# Altium schematic sheet SH1 - POWER, CAN, LED.SchDoc
size B
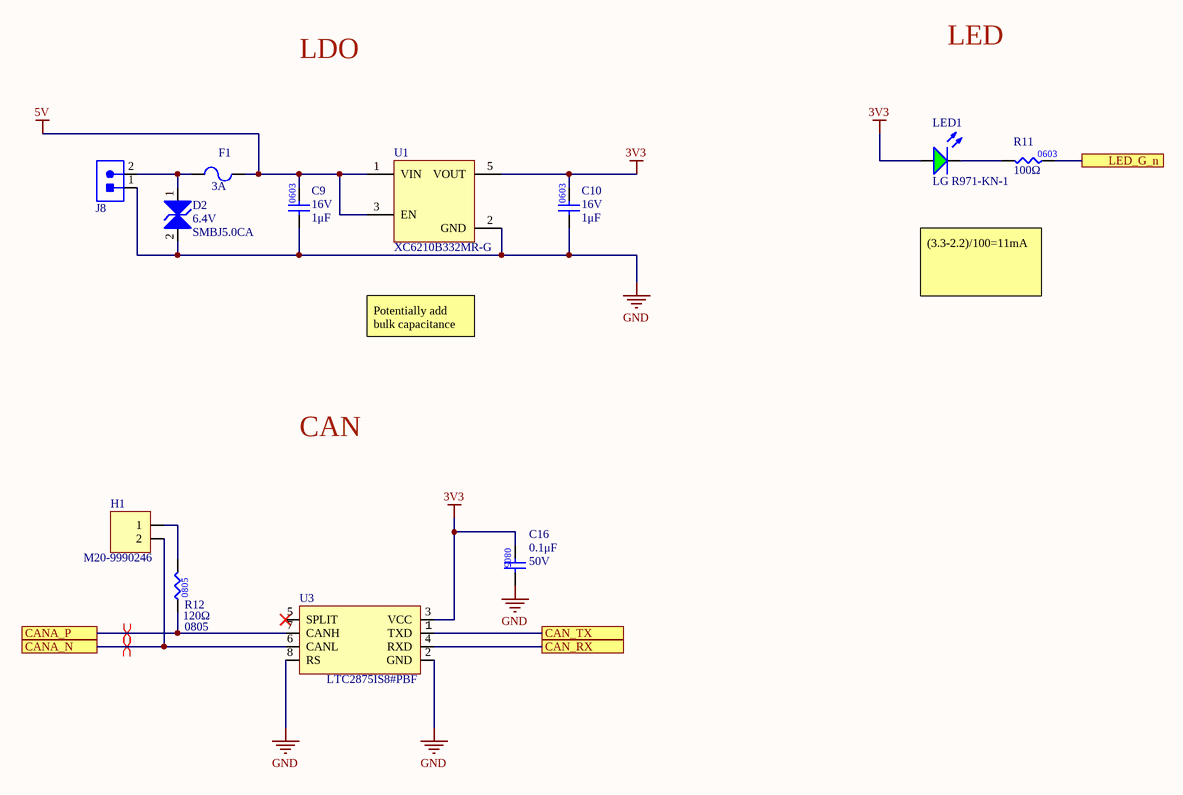
[diagram p0: SH1 - POWER, CAN, LED.SchDoc]

## Parts
C9  value 1μF  Voltage Rating: 16V  [CAP0603]  (hidden comment: CAP_1uF_16V_0603)
C10  value 1μF  Voltage Rating: 16V  [CAP0603]  (hidden comment: CAP_1uF_16V_0603)
C16  value 0.1μF  Voltage Rating: 50V  [CAP0805]  (hidden comment: CAP_0.1uF_50V_0805)
D2  Voltage - Breakdown (Min): 6.4V  Manufacturer Part Number 1: SMBJ5.0CA  [TVS_DIODE_BIDIR_SMB]  (hidden comment: TVS_DIODE_BIDIR_5V)
F1  FUSE_3A_0603  [FUSE_0603]  (value not drawn)
H1  Manufacturer Part Number 1: M20-9990246  [HDR1X2]  (hidden comment: JUMPER)
J8  CON_2POS_SCREW_TERM  [1935161]  (value not drawn)
LED1  Manufacturer Part Number 1: LG R971-KN-1  [LED_0805_GREEN]  (hidden comment: LED_GREEN)
R11  value 100Ω  [RES0603]  (hidden comment: RES_100Ω_0603_1%)
R12  value 120Ω  Package/Footprint: 0805  [RES0805]  (hidden comment: RES_120Ω_0805_1%)
U1  Manufacturer Part Number 1: XC6210B332MR-G  [SOT95P285X140-5N]  (hidden comment: LDO_3.3V_700mA)
U3  Manufacturer Part Number 1: LTC2875IS8#PBF  [LT-S8_N]  (hidden comment: IC_CAN_TRANSCEIVER)

## Ports
CAN_RX, CAN_TX, CANA_N, CANA_P, LED_G_n

## Nets
3V3: C10.2 C16.1 LED1.1(A) U1.5(VOUT) U3.3(VCC)
5V: C9.2 F1.2 U1.1(VIN) U1.3(EN)
GND: C9.1 C10.1 C16.2 D2.2 J8.1 U1.2(GND) U3.2(GND) U3.8(RS)
CAN_RX: U3.4(RXD) ; port CAN_RX
CAN_TX: U3.1(TXD) ; port CAN_TX
CANA_N: H1.2 U3.6(CANL) ; port CANA_N
CANA_P: R12.1 U3.7(CANH) ; port CANA_P
LED_G_n: R11.2 ; port LED_G_n
NetD2_1: D2.1 F1.1 J8.2
NetH1_1: H1.1 R12.2
NetLED1_2: LED1.2(K) R11.1

Not connected (* = marked no-connect by the designer): U3 5(SPLIT)*

## Layout directives
differential pair: CANA_N, CANA_P

## Notes on the sheet
- LDO
- LED
- (3.3-2.2)/100=11mA
- Potentially add bulk capacitance
- CAN
- (in symbol RES_100Ω_0603_1%) 0603

## Library data of the parts
C9 C10 = CAP_1uF_16V_0603: CAP CER 1UF 16V Y5V 0603; Manufacturer 1: Yageo; Manufacturer Part Number 1: CC0603ZRY5V7BB105; Supplier Part Number 1: 311-1372-1-ND; Supplier 1: Digi-Key; Mounting Type: SMD; Package: 0603; Dielectric: Y5V
C16 = CAP_0.1uF_50V_0805: CAP CER 0.1UF 50V X7R 0805; Manufacturer Part Number 1: GCM21BR71H104KA37K; Manufacturer 1: Murata Electronics; Package/Footprint: 0805; Supplier Part Number 1: 490-8049-1-ND; Supplier 1: Digi-Key; Dielectric: X7R; Mounting Type: SMD; LCSC Part #: C49678
D2 = TVS_DIODE_BIDIR_5V: TVS DIODE 5V 9.2V SMB; Manufacturer 1: Littelfuse; Package/Footprint: SMB; Supplier Part Number 1: SMBJ5.0CALFCT-ND; Supplier 1: Digi-Key; Mounting Type: SMD; Voltage - Reverse Standoff (Typ): 5V; Voltage - Clamping (Max) @ Ipp: 9.2V; Verified: No; LCSC Part #: *
F1 = FUSE_3A_0603: FUSE SMD 3A 32V 0603; Manufacturer Part Number 1: 0467003.NR; Manufacturer 1: Littelfuse; Supplier Part Number 1: F1399CT-ND; Supplier 1: Digi-Key; Voltage Rating (DC): 32V; Current Rating: 3A
H1 = JUMPER: HEADER 2X1; Manufacturer 1: Harwin Inc.; Package/Footprint: TH; Supplier 1: Digi-Key; Supplier Part Number 1: 952-2262-ND; Mounting Type: TH
J8 = CON_2POS_SCREW_TERM: TERM BLK 2POS SIDE ENTRY 5MM; Manufacturer 1: Phoenix Contact; Package/Footprint: SMD; Supplier 1: Digi-Key; Mounting Type: TH; Supplier Part Number 1: 277-1667-ND; Manufacturer Part Number 1: 1935161
LED1 = LED_GREEN: LED GREEN DIFFUSED 0805 SMD; Manufacturer 1: OSRAM; Forward Voltage Drop: 2.2V; Package/Footprint: 0805; Supplier Part Number 1: 475-1410-1-ND; Supplier 1: Digi-Key; Mounting Type: SMD
R11 = RES_100Ω_0603_1%: RES 100 OHM 1% 1/10W 0603; Manufacturer 1: Yageo; Manufacturer Part Number 1: RC0603FR-07100RL; Supplier Part Number 1: 311-100HRCT-ND; Supplier 1: Digi-Key
R12 = RES_120Ω_0805_1%: RES 120 OHM 1% 1/8W 0805; Manufacturer 1: Vishay; Manufacturer Part Number 1: CRCW0805120RFKEA; Supplier Part Number 1: 541-120CCT-ND; Supplier 1: Digi-Key; Mounting Type: SMD; LCSC Part #: C17437
U1 = LDO_3.3V_700mA: IC REG LINEAR 3.3V 700MA SOT25; Manufacturer 1: Diodes Incorporated; Input Voltage (Max): 6V; Voltage Dropout (Max): 0.075V; Package/Footprint: SOT-25; Output Voltage (Fixed): 3.3V; Output Current: 700mA; Operating Temperature: -40°C - 85°C; Mounting Type: SMD; Supplier 1: Digi-Key; Supplier Part Number 1: 893-1075-1-ND
U3 = IC_CAN_TRANSCEIVER: IC TXRX CAN 4MBPS 8SO; Manufacturer 1: Linear Technologies; Package/Footprint: 8-SOIC; Supplier Part Number 1: LTC2875IS8#PBF-ND; Supplier 1: Digi-Key; Mounting Type: SMD; LCSC Part #: C117076